# EAGLE design bmscablev4 (EAGLE 4.13)
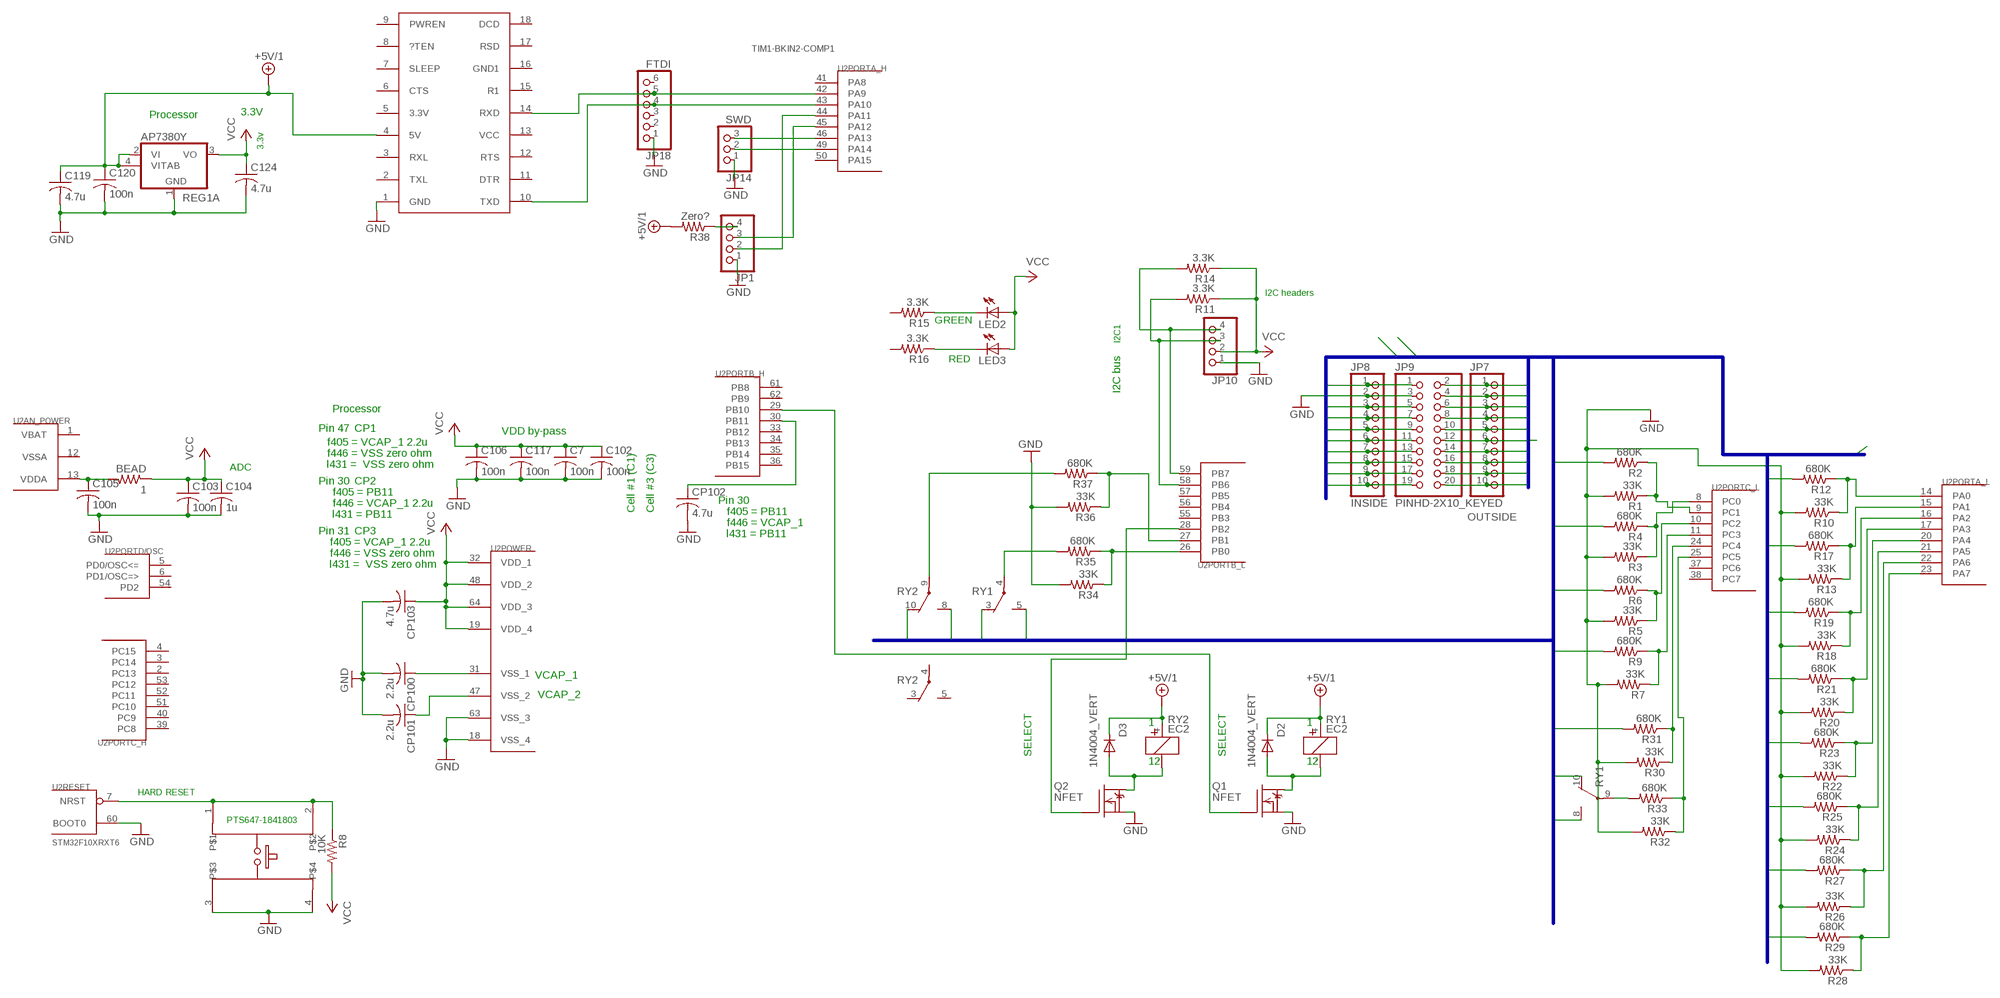
[diagram p0: schematic, sheet 1]

## Parts
BEAD  1  R-US_R0603  [R0603]
C7  100n  C-USC0603  [C0603]
C102  100n  C-USC0603  [C0603]
C103  100n  C-USC0603  [C0603]
C104  1u  C-USC0603  [C0603]
C105  100n  C-USC0603  [C0603]
C106  100n  C-USC0603  [C0603]
C117  100n  C-USC0603  [C0603]
C119  4.7u  C-USC0603  [C0603]
C120  100n  C-USC0603  [C0603]
C124  4.7u  C-USC0805  [C0805]
CP100  2.2u  C-USC0603  [C0603]
CP101  2.2u  C-USC0603  [C0603]
CP102  4.7u  C-USC0603  [C0603]
CP103  4.7u  C-USC0603  [C0603]
D2  1N4004_VERT  [DO41-10_VERT]
D3  1N4004_VERT  [DO41-10_VERT]
JP1  PINHD-1X4  [1X04]
JP7  OUTSIDE  PINHD-1X10  [1X10]
JP8  INSIDE  PINHD-1X10  [1X10]
JP9  PINHD-2X10_KEYED  [2X10_KEYED]
JP10  PINHD-1X4  [1X04]
JP14  SWD  PINHD-1X3  [1X03]
JP18  FTDI  PINHD-1X6  [1X06]
LED2  LEDCHIP-LED0603  [CHIP-LED0603]
LED3  LEDCHIP-LED0603  [CHIP-LED0603]
Q1  NFET  DMN3404L  [SOT-23]
Q2  NFET  DMN3404L  [SOT-23]
R1  33K  R-US_R0603  [R0603]
R2  680K  R-US_R0603  [R0603]
R3  33K  R-US_R0603  [R0603]
R4  680K  R-US_R0603  [R0603]
R5  33K  R-US_R0603  [R0603]
R6  680K  R-US_R0603  [R0603]
R7  33K  R-US_R0603  [R0603]
R8  10K  R-US_R0603  [R0603]
R9  680K  R-US_R0603  [R0603]
R10  33K  R-US_R0603  [R0603]
R11  3.3K  R-US_R0603  [R0603]
R12  680K  R-US_R0603  [R0603]
R13  33K  R-US_R0603  [R0603]
R14  3.3K  R-US_R0603  [R0603]
R15  3.3K  R-US_R0603  [R0603]
R16  3.3K  R-US_R0603  [R0603]
R17  680K  R-US_R0603  [R0603]
R18  33K  R-US_R0603  [R0603]
R19  680K  R-US_R0603  [R0603]
R20  33K  R-US_R0603  [R0603]
R21  680K  R-US_R0603  [R0603]
R22  33K  R-US_R0603  [R0603]
R23  680K  R-US_R0603  [R0603]
R24  33K  R-US_R0603  [R0603]
R25  680K  R-US_R0603  [R0603]
R26  33K  R-US_R0603  [R0603]
R27  680K  R-US_R0603  [R0603]
R28  33K  R-US_R0603  [R0603]
R29  680K  R-US_R0603  [R0603]
R30  33K  R-US_R0603  [R0603]
R31  680K  R-US_R0603  [R0603]
R32  33K  R-US_R0603  [R0603]
R33  680K  R-US_R0603  [R0603]
R34  33K  R-US_R0603  [R0603]
R35  680K  R-US_R0603  [R0603]
R36  33K  R-US_R0603  [R0603]
R37  680K  R-US_R0603  [R0603]
R38  Zero?  R-US_R0603  [R0603]
REG1A  AP7380Y  [SOT89]
RY1  EC2  [EC2]
RY2  EC2  [EC2]
U2  STM32F10XRXT6  [TQFP64]
U$1  E-SWITCH2  [E-SWITCH2]
U$3  USB-UART  [USB-UART]

## Nets
+5V/1: C119.1 C120.1 D2.C D3.C R38.2 REG1A.2(VI) REG1A.4(VITAB) RY1.+ RY2.+ U$3.4(5V)
C0: JP7.2 JP9.4 RY2.10(O)
C1: JP8.7 JP9.13 R19.2
C2: JP8.3 JP9.5 RY1.8(S)
C3: JP7.7 JP9.14 R21.2
C4: JP7.3 JP9.6 RY1.3(O)
C5: JP8.8 JP9.15 R12.2
C6: JP8.4 JP9.7 R31.2
C7: JP7.8 JP9.16 R17.2
C8: JP7.4 JP9.8 RY1.10(O)
C9: JP8.9 JP9.17 R6.2
C10: JP8.5 JP9.9 R27.2
C11: JP7.9 JP9.18 R9.2
C12: JP7.5 JP9.10 R29.2
C13: JP8.10 JP9.19 R4.2
C14: JP8.6 JP9.11 R23.2
C15: JP7.10 JP9.20 R2.2
C16: JP7.6 JP9.12 R25.2
CAN1-RX: JP1.2 U2.44(PORTA_H:PA11)
CAN1-TX: JP1.3 U2.45(PORTA_H:PA12)
CAN+5: JP1.4 R38.1
GND: C7.2 C102.2 C103.2 C104.2 C105.2 C106.2 C117.2 C119.2 C120.2 C124.2 CP100.2 CP101.2 CP102.2 CP103.2 JP1.1 JP8.2 JP9.3 JP10.1 JP14.1 JP18.1 Q1.2(S) Q2.2(S) R1.2 R3.2 R5.2 R7.2 R10.2 R13.2 R18.2 R20.2 R22.2 R24.2 R26.2 R28.2 R30.2 R32.2 R34.2 R36.2 REG1A.1(GND) U2.18(POWER:VSS_4) U2.60(RESET:BOOT0) U2.63(POWER:VSS_3) U$1.3 U$1.4 U$3.1(GND)
LED-EXT-GRN-CATHODE: LED2.C R15.1
LED-EXT-RED-CATHODE: LED3.C R16.1
N$3: R37.2 RY2.9(P)
N$4: R35.2 RY1.4(P)
N$5: R33.2 RY1.9(P)
NRST: R8.1 U2.7(RESET:NRST) U$1.1 U$1.2
PA0-C5-IN5: R10.1 R12.1 U2.14(PORTA_L:PA0)
PA2-C1-IN7: R18.1 R19.1 U2.16(PORTA_L:PA2)
PA3-C3-IN8: R20.1 R21.1 U2.17(PORTA_L:PA3)
PA4-C14-IN9: R22.1 R23.1 U2.20(PORTA_L:PA4)
PA5-C16-IN10: R24.1 R25.1 U2.21(PORTA_L:PA5)
PA6-C10-IN11: R26.1 R27.1 U2.22(PORTA_L:PA6)
PA7-C12-IN12: R28.1 R29.1 U2.23(PORTA_L:PA7)
PA9-USART1-TX: JP18.5 U2.42(PORTA_H:PA9) U$3.14(RXD)
PA10-USART1-RX: JP18.4 U2.43(PORTA_H:PA10) U$3.10(TXD)
PA13-SWDIO: JP14.3 U2.46(PORTA_H:PA13)
PA14-SWCLK: JP14.2 U2.49(PORTA_H:PA14)
PB0-XX-IN15: R34.1 R35.1 U2.26(PORTB_L:PB0)
PB1-XX-IN16: R36.1 R37.1 U2.27(PORTB_L:PB1)
PB2-Q2-GATE: Q2.1(G) U2.28(PORTB_L:PB2)
PB6-SCL-I2C1: JP10.3 R11.2 U2.58(PORTB_L:PB6)
PB7-SDA-I2C1: JP10.4 R14.2 U2.59(PORTB_L:PB7)
PB10-Q1-GATE: Q1.1(G) U2.29(PORTB_H:PB10)
PB11-I2C2-SDA|VCAP1: CP102.1 U2.30(PORTB_H:PB11)
PC0-C15-IN1: R1.1 R2.1 U2.9(PORTC_L:PC1)
PC1-C7-IN6: R13.1 R17.1 U2.15(PORTA_L:PA1)
PC1-C13-IN2: R3.1 R4.1 U2.8(PORTC_L:PC0)
PC2-C8-IN3: R5.1 R6.1 U2.10(PORTC_L:PC2)
PC3-C11-IN4: R7.1 R9.1 U2.11(PORTC_L:PC3)
PC4-C6-IN13: R30.1 R31.1 U2.24(PORTC_L:PC4)
PC5-C8-IN14: R32.1 R33.1 U2.25(PORTC_L:PC5)
PGND-SRN: JP8.1 JP9.1 RY1.5(S)
Q12-DRAIN-RELAY: D3.A Q2.3(D) RY2.-
Q12-DRAIN-RELAY1: D2.A Q1.3(D) RY1.-
SRP: JP7.1 JP9.2 RY2.8(S)
VCC: BEAD.1 C7.1 C102.1 C103.1 C104.1 C106.1 C117.1 C124.1 CP103.1 JP10.2 LED2.A LED3.A R8.2 R11.1 R14.1 REG1A.3(VO) U2.19(POWER:VDD_4) U2.32(POWER:VDD_1) U2.48(POWER:VDD_2) U2.64(POWER:VDD_3)
VDDA1: BEAD.2 C105.1 U2.13(AN_POWER:VDDA)
VSS_1-VCAP_1: CP100.1 U2.31(POWER:VSS_1)
VSS_3: CP101.1 U2.47(POWER:VSS_2)
Unconnected: JP18.2 JP18.3 JP18.6 R15.2 R16.2 RY2.3(O) RY2.4(P) RY2.5(S) U2.2(PORTC_H:PC13) U2.3(PORTC_H:PC14) U2.4(PORTC_H:PC15) U2.5(PORTD/OSC:PD0/OSC<=) U2.6(PORTD/OSC:PD1/OSC=>) U2.33(PORTB_H:PB12) U2.34(PORTB_H:PB13) U2.35(PORTB_H:PB14) U2.36(PORTB_H:PB15) U2.37(PORTC_L:PC6) U2.38(PORTC_L:PC7) U2.39(PORTC_H:PC8) U2.40(PORTC_H:PC9) U2.41(PORTA_H:PA8) U2.50(PORTA_H:PA15) U2.51(PORTC_H:PC10) U2.52(PORTC_H:PC11) U2.53(PORTC_H:PC12) U2.54(PORTD/OSC:PD2) U2.55(PORTB_L:PB3) U2.56(PORTB_L:PB4) U2.57(PORTB_L:PB5) U2.61(PORTB_H:PB8) U2.62(PORTB_H:PB9) U$3.2(TXL) U$3.3(RXL) U$3.5(3.3V) U$3.6(CTS) U$3.7(SLEEP) U$3.8(?TEN) U$3.9(PWREN) U$3.11(DTR) U$3.12(RTS) U$3.13(VCC) U$3.15(R1) U$3.16(GND1) U$3.17(RSD) U$3.18(DCD)

## Buses
HDR$:PGND-SRN,SRP,VSS,C[0..16]

## Notes on the sheet
- TIM1-BKIN2-COMP1
- Processor | 3.3V
- 3.3v
- I2C headers
- GREEN
- I2C1
- RED
- I2C bus
- Processor
- Pin 47 | CP1 | VDD by-pass
- f405 = VCAP_1 2.2u
- f446 = VSS zero ohm
- ADC | l431 =  VSS zero ohm
- Pin 30 | CP2
- f405 = PB11
- f446 = VCAP_1 2.2u | Pin 30
- Cell #1 (C1) | Cell #3 (C3) | f405 = PB11
- l431 = PB11
- f446 = VCAP_1
- Pin 31 | CP3 | l431 = PB11
- f405 = VCAP_1 2.2u
- f446 = VSS zero ohm
- l431 =  VSS zero ohm
- VCAP_1
- VCAP_2
- 1 | 1
- SELECT | SELECT
- 12 | 12
- HARD | RESET
- PTS647-1841803

## Power pins joined to a net without a drawn wire
VBAT: U2.1(AN_POWER:VBAT)
VSSA: U2.12(AN_POWER:VSSA)

## Library data of the parts
BEAD R1-R38 = rcl:R-US_: RESISTOR, American symbol
C7 C102-C106 C117 C119 C120 C124 CP100-CP103 = rcl:C-US: CAPACITOR, American symbol
D2 D3 = diode:1N4004_VERT
JP1 JP10 = pinhead:PINHD-1X4: PIN HEADER
JP7 JP8 = pinhead:PINHD-1X10: PIN HEADER
JP9 = pinhead:PINHD-2X10_KEYED
JP14 = pinhead:PINHD-1X3: PIN HEADER
JP18 = pinhead:PINHD-1X6: PIN HEADER
LED2 LED3 = led:LED: LED OSRAM: - CHIPLED LG R971, LG N971, LY N971, LG Q971, LY Q971, LO R971, LY R971 LH N974, LH R974 LS Q976, LO Q976, LY Q976 LO Q996 - Hyper CHIPLED LW Q18S LB Q993, LB Q99A, LB R99A - SideLED LS A670, LO A670, LY A670, LG A670, LP A670 LB A673, LV A673, LT A673, LW A673 LH A674 LY A675 LS A676, LA A676, LO A676, LY A676, LW A676 LS A679, LY A679, LG A679 - Hyper Micro SIDELED® LS Y876, LA Y876, LO Y876, LY Y876 LT Y87S - SmartLED LW L88C, LW L88S LB L89C, LB L89S, LG L890 LS L89K, LO L89K, LY L89K LS L896, LA L896, LO L896, LY L896 - TOPLED LS T670, LO T670, LY T670, LG T670, LP T670 LSG T670, LSP T670, LSY T670, LOP T670, LYG T670 LG T671, LOG T671, LSG T671 LB T673, LV T673, LT T673, LW T673 LH T674 LS T676, LA T676, LO T676, LY T676, LB T676, LH T676, LSB T676, LW T676 LB T67C, LV T67C, LT T67C, LS T67K, LO T67K, LY T67K, LW E67C LS E67B, LA E67B, LO E67B, LY E67B, LB E67C, LV E67C, LT E67C LW T67C LS T679, LY T679, LG T679 LS T770, LO T770, LY T770, LG T770, LP T770 LB T773, LV T773, LT T773, LW T773 LH T774 LS E675, LA E675, LY E675, LS T675 LS T776, LA T776, LO T776, LY T776, LB T776 LHGB T686 LT T68C, LB T68C - Hyper Mini TOPLED® LB M676 - Mini TOPLED Santana® LG M470 LS M47K, LO M47K, LY M47K Source: http://www.osram.convergy.de/
Q1 Q2 = transistor-fet:DMN3404L
REG1A = linear:AP7380Y
RY1 RY2 = relay:EC2
U2 = stm32:STM32F10XRXT6: STM32F101/103 64pin LQFP
U$1 = switch-misc:E-SWITCH2
U$3 = pinhead:USB-UART

## Board
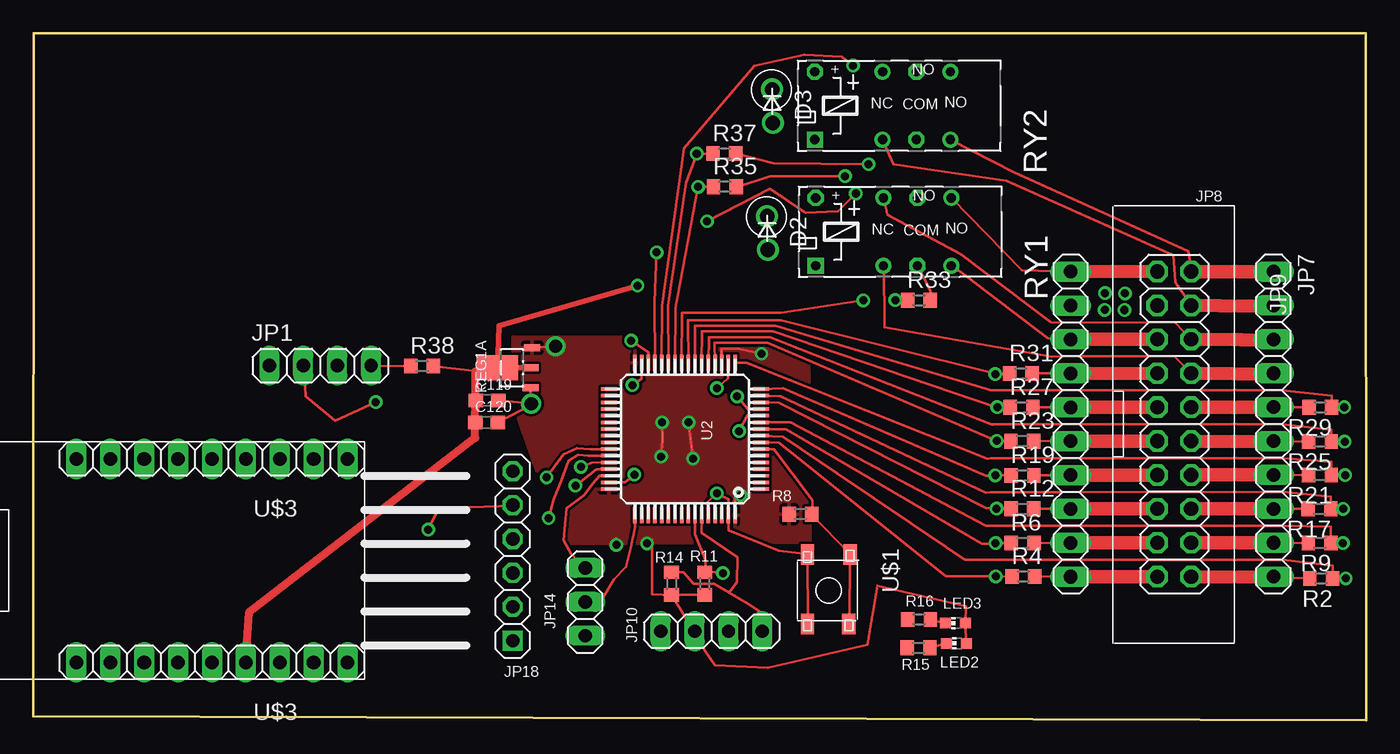
[diagram p1: board, top side]
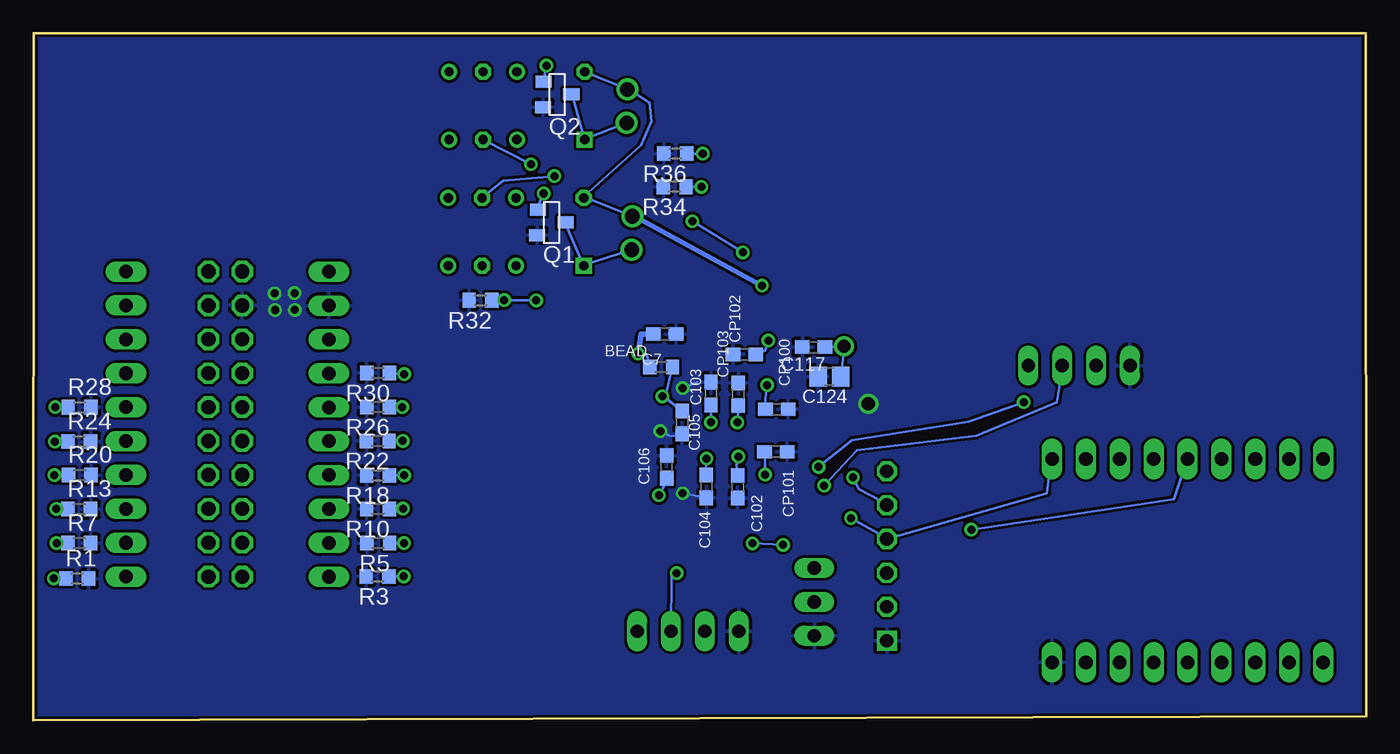
[diagram p2: board, bottom side, seen from below]

Size 99.91 x 51.49 mm. Coordinates in mm from the lower left corner, seen from the top.
Outline: 0,0.31 0.04,51.48 99.87,51.49 99.91,0 0,0.31
Copper layers (1*16): Top 0.035mm / dielectric 1.5mm / Bottom 0.035mm
Design rules "default": minimum track width 8mil, minimum drill 0.6mm, track to track 8mil, track to pad 8mil, pad to pad 8mil, via to via 8mil, smd to smd 0mil, copper to edge 8mil, drill to drill 8mil, minimum pad ring 10mil, minimum via ring 8mil, stop-mask expansion 4mil, vias tented up to drill 0mil, thermal gap 10mil

### Footprints (pad centres in the part's own frame; a part is rotated, then mirrored left to right if it is on the bottom)
R0603 = smd 1 x 1.1: 1 -0.85,0; 2 0.85,0
C0603 = smd 1.1 x 1: 1 -0.85,0; 2 0.85,0
C0805 = smd 1.3 x 1.5: 1 -0.85,0; 2 0.85,0
DO41-10_VERT = drill 1.1 round: A 2.58,0.05; C 0.07,0
1X04 = drill 1 long: 1 -3.81,0; 2 -1.27,0; 3 1.27,0; 4 3.81,0
1X10 = drill 1.016 long: 1 -11.43,0; 2 -8.89,0; 3 -6.35,0; 4 -3.81,0; 5 -1.27,0; 6 1.27,0; 7 3.81,0; 8 6.35,0; 9 8.89,0; 10 11.43,0
2X10_KEYED = drill 1.067 octagon: 1 -11.46,-1.27; 2 -11.46,1.27; 3 -8.92,-1.27; 4 -8.92,1.27; 5 -6.38,-1.27; 6 -6.38,1.27; 7 -3.84,-1.27; 8 -3.84,1.27; 9 -1.3,-1.27; 10 -1.3,1.27; 11 1.24,-1.27; 12 1.24,1.27; 13 3.78,-1.27; 14 3.78,1.27; 15 6.32,-1.27; 16 6.32,1.27; 17 8.86,-1.27; 18 8.86,1.27; 19 11.4,-1.27; 20 11.4,1.27
1X03 = drill 1 long: 1 -2.54,0; 2 0,0; 3 2.54,0
1X06 = drill 1 square: 1 -6.35,0 | drill 1 octagon: 2 -3.81,0; 3 -1.27,0; 4 1.27,0; 5 3.81,0; 6 6.35,0
CHIP-LED0603 = smd 0.8 x 0.8: A 0,-0.75; C 0,0.75
SOT-23 = smd 0.9 x 1.2: 1 -1,-1.006; 2 0.9,-1.056; 3 -0.05,1.056
SOT89 = smd 0.55 x 1.2: 1 -1.5,-1.4; 2 0,-1.4; 3 1.5,-1.5 | smd 1.85 x 3.1: 4 0,1.1
EC2 = drill 0.7 round: 3 -1.27,2.54; 5 3.81,2.54; 8 3.81,-2.54; 10 -1.27,-2.54 | drill 0.7 octagon: 4 1.27,2.54; 9 1.27,-2.54; + -6.35,2.54 | drill 0.7 square: - -6.35,-2.54
TQFP64 = smd 1.2 x 0.26: 1 -5.7,3.75; 2 -5.7,3.25; 3 -5.7,2.75; 4 -5.7,2.25; 5 -5.7,1.75; 6 -5.7,1.25; 7 -5.7,0.75; 8 -5.7,0.25; 9 -5.7,-0.25; 10 -5.7,-0.75; 11 -5.7,-1.25; 12 -5.7,-1.75; 13 -5.7,-2.25; 14 -5.7,-2.75; 15 -5.7,-3.25; 16 -5.7,-3.75; 33 5.7,-3.75; 34 5.7,-3.25; 35 5.7,-2.75; 36 5.7,-2.25; 37 5.7,-1.75; 38 5.7,-1.25; 39 5.7,-0.75; 40 5.7,-0.25; 41 5.7,0.25; 42 5.7,0.75; 43 5.7,1.25; 44 5.7,1.75; 45 5.7,2.25; 46 5.7,2.75; 47 5.7,3.25; 48 5.7,3.75 | smd 0.26 x 1.2: 17 -3.75,-5.7; 18 -3.25,-5.7; 19 -2.75,-5.7; 20 -2.25,-5.7; 21 -1.75,-5.7; 22 -1.25,-5.7; 23 -0.75,-5.7; 24 -0.25,-5.7; 25 0.25,-5.7; 26 0.75,-5.7; 27 1.25,-5.7; 28 1.75,-5.7; 29 2.25,-5.7; 30 2.75,-5.7; 31 3.25,-5.7; 32 3.75,-5.7; 49 3.75,5.7; 50 3.25,5.7; 51 2.75,5.7; 52 2.25,5.7; 53 1.75,5.7; 54 1.25,5.7; 55 0.75,5.7; 56 0.25,5.7; 57 -0.25,5.7; 58 -0.75,5.7; 59 -1.25,5.7; 60 -1.75,5.7; 61 -2.25,5.7; 62 -2.75,5.7; 63 -3.25,5.7; 64 -3.75,5.7
E-SWITCH2 = smd 1.55 x 1: 1 -2.7,1.6; 2 2.5,1.5; 3 2.5,-1.6; 4 -2.7,-1.6
USB-UART = drill 1.016 long: 1 -7.62,-8.89; 2 -7.62,-6.35; 3 -7.62,-3.81; 4 -7.62,-1.27; 5 -7.62,1.27; 6 -7.62,3.81; 7 -7.62,6.35; 8 -7.62,8.89; 9 -7.62,11.43; 10 7.62,-8.89; 11 7.62,-6.35; 12 7.62,-3.81; 13 7.62,-1.27; 14 7.62,1.27; 15 7.62,3.81; 16 7.62,6.35; 17 7.62,8.89; 18 7.62,11.43

### Placement (x,y rotation side)
BEAD  52.85,26.5 0 bottom
C7  52.58,28.96 0 bottom
C102  47.11,17.51 270 bottom
C103  49.11,24.49 90 bottom
C104  49.46,17.54 270 bottom
C105  51.27,22.34 270 bottom
C106  52.44,19 90 bottom
C117  41.42,27.98 180 bottom
C119  34.01,23.99 0 top
C120  33.98,22.33 0 top
C124  40.23,25.77 180 bottom
CP100  44.18,23.32 0 bottom
CP101  44.25,20.14 0 bottom
CP102  46.61,27.43 180 bottom
CP103  47.06,24.45 90 bottom
D2  55.01,37.85 270 top
D3  55.38,47.36 270 top
JP1  21.51,26.59 0 top
JP7  92.96,22.21 270 top
JP8  77.76,22.2 270 top
JP9  85.52,22.18 270 top
JP10  50.84,6.69 0 top
JP14  41.37,8.89 90 top
JP18  35.93,12.33 90 top
LED2  69.2,5.78 90 top
LED3  69.12,7.3 90 top
Q1  61.08,37.27 270 bottom
Q2  60.64,46.86 270 bottom
R1  96.62,10.63 0 bottom
R2  96.54,10.64 180 top
R3  74.11,10.8 180 bottom
R4  74.22,10.8 0 top
R5  74.05,13.29 180 bottom
R6  74.16,13.3 0 top
R7  96.47,13.29 0 bottom
R8  57.51,15.46 180 top
R9  96.42,13.3 180 top
R10  74.08,15.85 180 bottom
R11  50.33,10.26 90 top
R12  74.14,15.86 0 top
R13  96.47,15.84 0 bottom
R14  47.84,10.26 90 top
R15  66.36,5.45 180 top
R16  66.4,7.57 180 top
R17  96.41,15.86 180 top
R18  74.08,18.37 180 bottom
R19  74.15,18.37 0 top
R20  96.43,18.39 0 bottom
R21  96.44,18.39 180 top
R22  74.09,20.95 180 bottom
R23  74.13,20.93 0 top
R24  96.47,20.9 0 bottom
R25  96.45,20.91 180 top
R26  74.06,23.48 180 bottom
R27  74.08,23.47 0 top
R28  96.45,23.47 0 bottom
R29  96.47,23.47 180 top
R30  74.06,26.04 180 bottom
R31  74.03,26 0 top
R32  66.4,31.49 180 bottom
R33  66.39,31.49 0 top
R34  51.83,40 180 bottom
R35  51.84,40 0 top
R36  51.79,42.48 180 bottom
R37  51.8,42.48 0 top
R38  29.14,26.56 0 top
REG1A  35.89,26.43 90 top
RY1  65,36.62 0 top
RY2  64.93,46.07 0 top
U2  48.85,21.09 180 top
U$1  59.63,9.74 270 top
U$3  14.66,11.98 90 top

### Tracks (layer width: path | path; a pad name or v marks a point on that pad's centre or on a via)
+5V/1  (via drill 0.6)
  Top 0.203: REG1A.4 34.81,26.43 33.74,26.3 33.71,26.3 | 33.3,26.2 33.3,26.18 R38.2 | C119.1 33.02,24.44 33.16,24.04
  Top 0.406: 34.81,26.43 34.93,29.58 v45.29,32.59 | REG1A.4 34.82,26.44 REG1A.2
  Top 0.61: 33.16,24.04 C120.1 33.13,21.18 16.18,8.12 U$3.4 | C119.1 33.15,26.16 33.3,26.2 33.74,26.3
  Bottom 0.203: RY2.+ 58.6,48.62 D3.C 54.61,47.3 54.81,46.99 | 58.68,39.24 RY1.+ | D2.C 58.68,39.24 | 58.68,39.24 54.35,43.1 53.57,44.92 53.72,46.3 54.81,46.99 | 54.81,46.99 55.37,47.35
  Bottom 0.406: D2.C 54.91,37.82 v45.29,32.59
C0
  Top 0.203: JP7.2 92.9,30.97 | 86.75,31.1 JP9.4 86.88,31.02 85.59,32.83 85.47,34.85 72.93,40.45 64.49,41.67 RY2.10
  Top 0.61: 88.93,31.08 88.93,31.03 88.69,31
  Top 1.016: JP7.2 92.99,31.04 88.93,31.08 JP9.4
C1
  Top 0.203: 77.8,18.38 JP8.7 R19.2
  Top 1.016: JP9.13 84.28,18.39 JP8.7
C2
  Top 0.203: JP8.3 77.85,28.58 76.05,28.65 68.86,34.11 RY1.8
  Top 1.016: JP9.5 JP8.3
C3
  Top 0.203: 91,18.4 90.63,18.38 | R21.2 93.01,18.4
  Top 1.016: 93.01,18.4 JP7.7 91,18.4 JP9.14
C4
  Top 0.203: 90.55,28.53 90.55,28.48 90.01,28.52 | JP9.6 86.86,28.49 85.59,29.8 76.27,29.83 69.52,34.94 64.01,37.91 63.74,39.23 RY1.3
  Top 1.016: JP7.3 92.97,28.51 90.55,28.53 JP9.6
C5
  Top 0.203: 77.88,15.8 JP8.8 R12.2
  Top 1.016: JP9.15 84.3,15.85 JP8.8
C6
  Top 0.203: JP8.4 77.84,26.01 | JP8.4 77.81,25.9 | R31.2 74.91,26.03 JP8.4
  Top 1.016: JP9.7 84.28,26 JP8.4
C7
  Top 0.203: JP9.16 86.84,15.87 | R17.2 95.53,15.85 93.01,15.85
  Top 1.016: JP7.8 93.01,15.85 JP9.16
C8
  Top 0.203: 86.95,26.14 JP9.8 86.83,25.99 85.53,27.28 77.13,27.29 76.35,27.24 63.79,29.45 63.76,34.18 RY1.10
  Top 1.016: JP7.4 93.01,25.94 JP9.8
C9
  Top 0.203: 77.84,13.36 JP8.9 77.76,13.27 R6.2
  Top 1.016: JP9.17 JP8.9
C10
  Top 0.203: 77.84,23.5 JP8.5 74.89,23.46 R27.2
  Top 1.016: JP9.9 84.3,23.47 JP8.5
C11
  Top 0.203: JP9.18 86.74,13.39 | R9.2 93.03,13.3
  Top 1.016: JP7.9 93.03,13.3 JP9.18
C12
  Top 0.203: 89.07,23.47 89.07,23.42 89.05,23.43 | R29.2 95.65,23.48 93.01,23.46
  Top 1.016: JP7.5 93.01,23.46 89.07,23.47 JP9.10
C13
  Top 0.203: 77.78,10.69 JP8.10 77.79,10.76 R4.2
  Top 1.016: JP9.19 84.28,10.77 JP8.10
C14
  Top 0.203: 82.08,20.93 82.08,20.96 82.04,20.94 | R23.2 74.99,20.95 JP8.6
  Top 1.016: JP9.11 84.28,20.93 82.08,20.93 JP8.6
C15
  Top 0.203: R2.2 95.65,10.64 93.06,10.75
  Top 1.016: JP7.10 93.06,10.75 JP9.20
  Bottom 0.203: JP9.20 86.88,10.85
C16
  Top 0.203: R25.2 95.63,20.91 92.99,20.89
  Top 0.406: JP7.6 92.91,21.03
  Top 1.016: JP7.6 92.99,20.89 JP9.12
CAN1-RX  (via drill 0.6)
  Top 0.203: U2.44 41.89,19.32 v41.05,19.01 | v25.67,23.85 22.62,22.45 20.42,24.29 20.29,26.56 JP1.2
  Bottom 0.203: v41.05,19.01 38.55,21.01 29.81,22.37 v25.67,23.85
CAN1-TX  (via drill 0.6)
  Top 0.203: U2.45 42.23,18.83 v40.64,17.6
  Bottom 0.203: v40.64,17.6 38.17,20.26 29.21,21.35 23.2,23.85 22.72,26.59 JP1.3
CAN+5
  Top 0.203: R38.1 28.35,26.56 JP1.4
GND  (via drill 0.6, 1)
  Top 0.203: U2.18 52.08,25.65 v51.24,24.9 | U2.60 50.54,16.36 v51.23,17.03 51.39,16.93 52.11,16.56 U2.63 52.1,14.25 55.91,12.71 58.11,12.47 U$1.4 58.06,7.23 U$1.3 | v52.91,21.69 53.54,22.87 | v37.32,23.74 REG1A.1 | v37.32,23.74 37.42,23.72 C119.2 | v37.32,23.74 37.43,23.69 C120.2
  Bottom 0.203: 50.16,25.36 v51.24,24.9 | v51.23,17.03 49.85,16.76 | v52.91,21.69 52.21,21.32 51.51,21.29 C105.2 | v37.32,23.74 37.3,23.66
  other vias: 81.83,32.01 81.79,30.76 80.33,32.02 80.32,30.77
  pour Bottom (rank 3): -0.51,54.65 -0.59,-0.79 100.7,-1.01 100.7,54.43
LED-EXT-GRN-CATHODE
  Top 0.203: LED2.C 68.43,5.8 R15.1
LED-EXT-RED-CATHODE
  Top 0.203: LED3.C 68.26,7.29 R16.1
N$3  (via drill 0.6)
  Top 0.203: v62.61,41.68 55.47,41.76 52.73,42.46 R37.2
  Bottom 0.203: v62.61,41.68 RY2.9
N$4  (via drill 0.6)
  Top 0.203: v60.85,40.8 55.21,40.78 52.71,39.94 R35.2
  Bottom 0.203: RY1.4 64.71,40.46 v60.85,40.8
N$5
  Top 0.203: RY1.9 67.25,32.19 67.27,31.44 R33.2
NRST
  Top 0.203: U$1.2 61.18,7.24 U$1.1 58.34,15.44 R8.1 58.44,15.48 58.4,16.52 55.52,20.34 U2.7
PA0-C5-IN5  (via drill 0.6)
  Top 0.203: R12.1 73.21,15.88 v72.2,15.87 72.23,15.95 71.45,15.89 55.89,23.81 U2.14
  Bottom 0.203: v72.2,15.87 R10.1
PA2-C1-IN7  (via drill 0.6)
  Top 0.203: R19.1 v72.1,18.37 72.16,18.35 71.39,18.35 56.19,24.88 U2.16
  Bottom 0.203: R18.1 v72.1,18.37
PA3-C3-IN8  (via drill 0.6)
  Top 0.203: v98.33,18.38 97.32,18.37 R21.1 97.29,19.37 93.68,19.66 77.05,19.64 71.77,19.64 71.5,19.62 53.46,26.8 U2.17
  Bottom 0.203: v98.33,18.38 R20.1
PA4-C14-IN9  (via drill 0.6)
  Top 0.203: R23.1 v72.22,20.95 72.26,20.94 55.03,28.32 51.07,28.32 U2.20
  Bottom 0.203: 73.27,20.95 R22.1 v72.22,20.95
PA5-C16-IN10  (via drill 0.6)
  Top 0.203: v98.3,20.89 R25.1 97.29,21.79 93.6,22.2 76.98,22.19 71.88,22.2 | 71.88,22.2 71.84,22.2 | U2.21 50.65,28.73 55.21,28.73 71.88,22.16 71.88,22.2
  Bottom 0.203: v98.3,20.89 R24.1
PA6-C10-IN11  (via drill 0.6)
  Top 0.203: R27.1 73.25,23.47 v72.25,23.48 72.39,23.41 55.43,29.16 50.12,29.16 U2.22
  Bottom 0.203: v72.25,23.48 R26.1
PA7-C12-IN12  (via drill 0.6)
  Top 0.203: R29.1 | R29.1 v98.27,23.48 | R29.1 97.33,24.35 93.58,24.75 77,24.74 71.77,24.75 | 71.77,24.75 71.74,24.75 | U2.23 49.6,29.58 55.65,29.59 71.77,24.75 | 71.77,24.75
  Bottom 0.203: v98.27,23.48 R28.1
PA9-USART1-TX  (via drill 0.6)
  Top 0.203: U2.42 41.76,20.34 40.76,20.41 39.76,19.94 v38.47,18.22 | v29.6,14.3 30.36,15.9 36.05,16.1 JP18.5
  Bottom 0.203: JP18.5 35.82,16.16 | 35.82,16.16 38.01,17.32 v38.47,18.22 | 35.82,16.16 35.58,16 | U$3.14 14.42,16.59 v29.6,14.3
PA10-USART1-RX  (via drill 0.6)
  Top 0.203: U2.43 41.63,19.83 40.84,19.9 40.13,19.46 39.54,17.93 39,16.55 v38.62,15.17
  Bottom 0.203: 35.83,13.6 JP18.4 | 35.83,13.6 v38.62,15.17 | 35.83,13.6 23.92,17.03 23.62,19.49 U$3.10
PA13-SWDIO
  Top 0.203: U2.46 42.44,18.35 41.94,17.78 41.29,16.88 39.96,15.92 39.73,13.51 40.29,12.5 41.33,11.42 JP14.3
PA14-SWCLK
  Top 0.203: U2.49 45.09,14.48 44.81,13.03 44.43,11.51 43.52,10.6 42.48,8.82 JP14.2
PB0-XX-IN15  (via drill 0.6)
  Top 0.203: R35.1 R34.1 v49.84,39.98 49.81,39.98 48.13,30.91 U2.26
  Bottom 0.203: v49.84,39.98 R34.1
PB1-XX-IN16  (via drill 0.6)
  Top 0.203: R37.1 v49.73,42.48 49.75,42.46 48.94,40.28 47.59,31.08 U2.27
  Bottom 0.203: v49.73,42.48 R36.1
PB2-Q2-GATE  (via drill 0.6)
  Top 0.203: U2.28 47.11,31.07 48.78,42.88 54.06,49.05 57.8,49.89 60.63,49.74 v61.45,49.07
  Bottom 0.203: Q2.1 61.7,47.89 v61.45,49.07
PB6-SCL-I2C1  (via drill 0.6)
  Top 0.203: 52.14,6.66 JP10.3 52.11,6.66 | v51.68,11.04 50.3,11.23 R11.2 50.34,11.05 50.38,12.02 49.61,13.97 U2.58
  Bottom 0.203: JP10.3 52.06,10.87 v51.68,11.04
PB7-SDA-I2C1
  Top 0.203: 54.62,6.74 JP10.4 54.67,6.65 54.64,8.02 53.56,8.74 51.04,10.25 | 51.04,10.25 49.48,10.25 48.72,11.1 R14.2 | U2.59 50.11,15.28 50.1,14.07 52.79,12.22 52.75,10.34 52.15,9.58 | 52.15,9.58 | 52.15,9.58 52.19,9.58 51.04,10.25
PB10-Q1-GATE  (via drill 0.6)
  Top 0.203: U2.29 46.57,31.33 v46.73,35.07 | v50.51,37.41 55.21,39.86 57.89,38.04 60.32,38.17 v61.65,39.49
  Bottom 0.203: v46.73,35.07 v50.51,37.41 | Q1.1 62.23,38.22 v61.65,39.49
PB11-I2C2-SDA|VCAP1  (via drill 0.6)
  Top 0.203: v44.82,28.47 46.1,27.59 U2.30
  Bottom 0.203: CP102.1 45.07,27.7 v44.82,28.47
PC0-C15-IN1  (via drill 0.6)
  Top 0.203: v98.38,10.64 R2.1 97.4,11.59 93.65,12.05 77.08,12.03 72.24,12.04 | 72.24,12.04 72.08,12.04 | U2.9 56.2,21.25 69.82,12.04 72.24,12.03 72.24,12.04
  Bottom 0.203: R1.1 97.45,10.63 v98.38,10.64
PC1-C7-IN6  (via drill 0.6)
  Top 0.203: v98.19,15.85 R17.1 97.26,16.75 93.66,17.13 77.02,17.09 71.79,17.09 71.42,17.06 56.01,24.3 U2.15
  Bottom 0.203: R13.1 97.36,15.84 v98.19,15.85
PC1-C13-IN2  (via drill 0.6)
  Top 0.203: R4.1 73.41,10.77 v72.14,10.79 | U2.8 55.91,20.82 68.4,10.79 v72.14,10.79 | v72.14,10.79 72.24,10.79
  Bottom 0.203: v72.14,10.79 R3.1
PC2-C8-IN3  (via drill 0.6)
  Top 0.203: R6.1 73.38,13.28 v72.12,13.29 72.21,13.26 71.1,13.26 56.42,21.81 U2.10
  Bottom 0.203: v72.12,13.29 R5.1
PC3-C11-IN4  (via drill 0.6)
  Top 0.203: v98.17,13.29 R9.1 97.25,14.51 93.62,14.59 77.07,14.59 71.88,14.58 71.42,14.58 56.75,22.34 U2.11
  Bottom 0.203: R7.1 v98.17,13.29
PC4-C6-IN13  (via drill 0.6)
  Top 0.203: R31.1 v72.11,25.96 72.16,25.97 56.03,30.01 49.09,30 U2.24
  Bottom 0.203: R30.1 72.08,25.96 v72.11,25.96
PC5-C8-IN14  (via drill 0.6)
  Top 0.203: v64.62,31.5 R33.1 | v62.22,31.48 56.06,30.55 48.61,30.56 U2.25
  Bottom 0.203: R32.1 v64.62,31.5 v62.22,31.48
PGND-SRN
  Top 0.203: RY1.5 74.1,33.72 77.83,33.64 JP8.1
  Top 1.016: JP9.1 84.28,33.65 JP8.1
  Bottom 0.203: JP8.1 77.76,33.6
Q12-DRAIN-RELAY
  Bottom 0.203: D3.A 58.61,43.55 RY2.- 59.54,46.91 Q2.3
Q12-DRAIN-RELAY1
  Bottom 0.203: D2.A 58.72,34.1 RY1.- 60.07,37.28 Q1.3
SRP
  Top 0.203: RY2.8 73.52,41.08 86.59,35.17 86.83,33.53 JP9.2
  Top 1.016: JP7.1 92.99,33.61 JP9.2
VCC  (via drill 0.6, 1)
  Top 0.203: U2.64 52.59,16.71 v53.02,16.88 | U2.19 51.58,27.84 52.86,27.85 v54.58,27.48 | v49.45,19.63 v49.13,22.33 | v47.14,22.34 47.15,21.01 v47.06,19.78 | 69.96,5.83 LED2.A 69.92,5.78 LED3.A 69.91,8.57 63.29,10.08 62.51,5.68 55.06,3.97 51.1,4.13 49.43,6.58 JP10.2 | JP10.2 49.58,6.66 | JP10.2 49.55,6.63 R14.1 | R14.1 R11.1 | 51.59,27.83 51.59,26.29 | REG1A.3 37.3,27.93 v39.14,28.04 | R14.1 47.92,9.4 46.39,9.46 46.39,13.55 v46,13.27 | v43.71,13.16 43.69,13.67
  Bottom 0.203: C106.1 52.51,17.76 v53.02,16.88 | BEAD.1 53.95,27.44 v54.58,27.48 | v49.13,22.33 C103.1 | C104.1 49.49,19.04 v49.45,19.63 | v47.14,22.34 CP103.1 | C102.1 47.19,19.19 v47.06,19.78 | C117.1 v39.14,28.04 39.09,28.06 C124.1 | v46,13.27 v43.71,13.16
  Bottom 0.406: C7.1 54.34,28.94 54.58,27.45 v54.58,27.48
  pour Top (rank 3): 35.91,28.8 36.01,23.54 39.66,13.19 58.27,13.3 58.13,28.77
VDDA1  (via drill 0.6)
  Top 0.203: U2.13 53.57,23.34 v52.75,24.29
  Bottom 0.203: BEAD.2 52.55,24.17 C105.1 52.56,24.29 v52.75,24.29
VSS_1-VCAP_1  (via drill 0.6)
  Top 0.203: U2.31 45.6,25.6 v44.91,25.13
  Bottom 0.203: CP100.1 45.03,24.15 v44.91,25.13
VSS_3  (via drill 0.6)
  Top 0.203: U2.47 44.35,17.84 v45.06,18.43
  Bottom 0.203: CP101.1 45.04,18.46 v45.06,18.43

### Text on the board
tValues: 3.3V | DIGITAL | +5V | 3.2v | ANALOG | 3.2